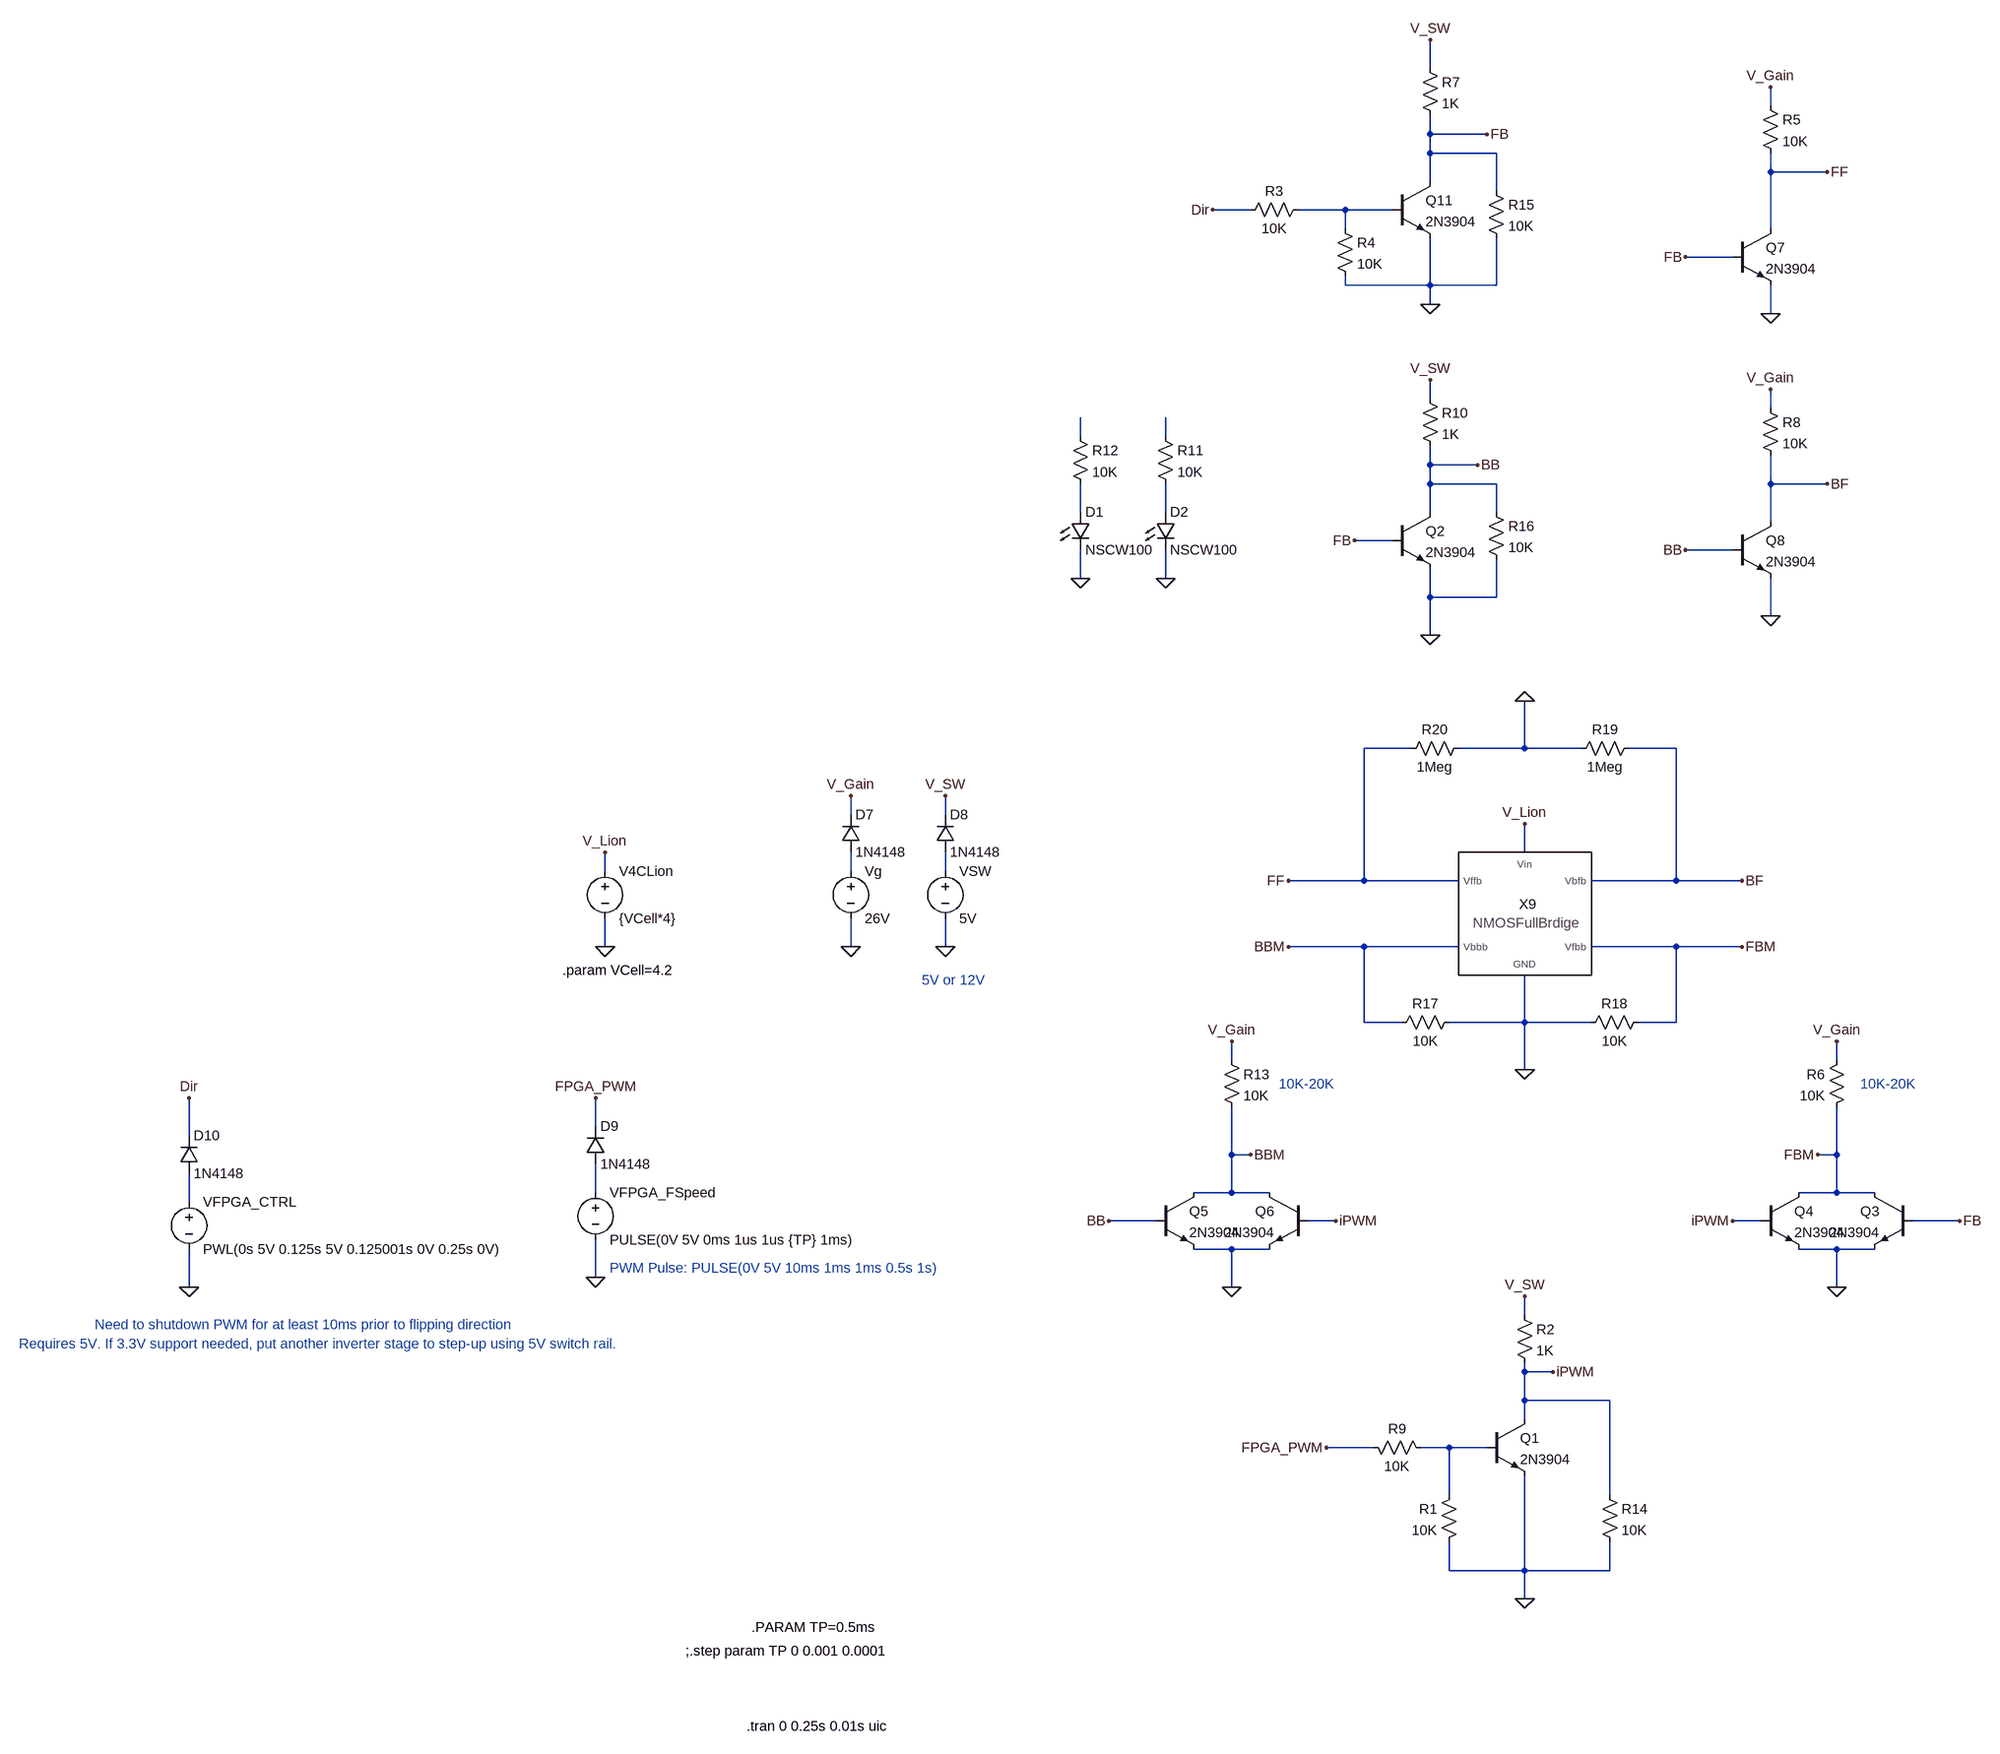
[diagram p0: schematic MotorControllerV2.asc]
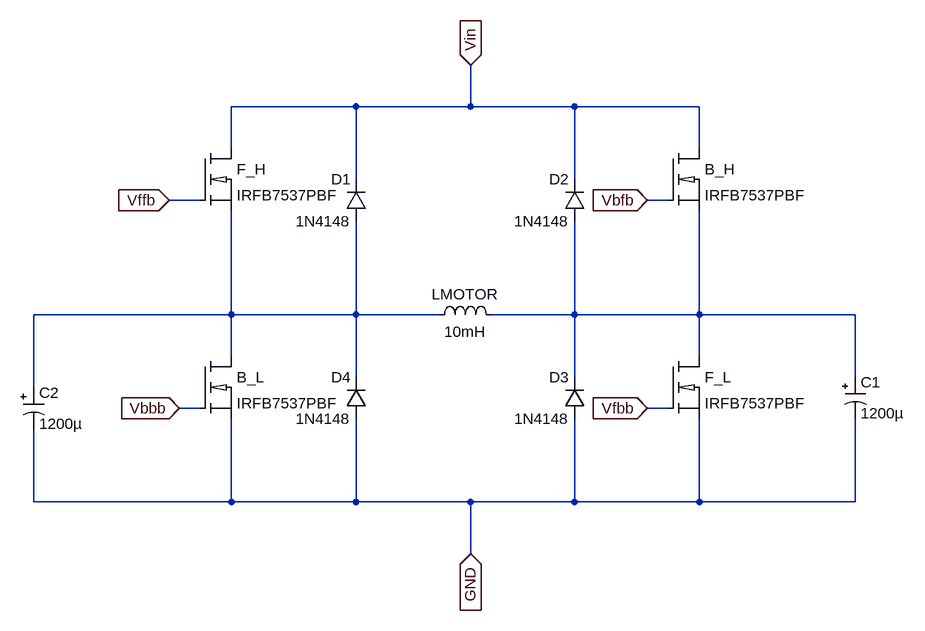
[diagram p1: sub-circuit nmosfullbridge.asc]
MotorControllerV2.asc, the LTspice schematic file:
Version 4
SHEET 1 2712 2204
WIRE 272 -1712 272 -1760
WIRE 848 -1648 848 -1680
WIRE 272 -1600 272 -1632
WIRE 368 -1600 272 -1600
WIRE 272 -1568 272 -1600
WIRE 384 -1568 272 -1568
WIRE 848 -1536 848 -1568
WIRE 944 -1536 848 -1536
WIRE 272 -1520 272 -1568
WIRE 384 -1504 384 -1568
WIRE -32 -1472 -96 -1472
WIRE 128 -1472 48 -1472
WIRE 208 -1472 128 -1472
WIRE 128 -1440 128 -1472
WIRE 848 -1440 848 -1536
WIRE 784 -1392 704 -1392
WIRE 128 -1344 128 -1360
WIRE 272 -1344 272 -1424
WIRE 272 -1344 128 -1344
WIRE 384 -1344 384 -1424
WIRE 384 -1344 272 -1344
WIRE 272 -1312 272 -1344
WIRE 848 -1296 848 -1344
WIRE 272 -1152 272 -1184
WIRE 848 -1136 848 -1168
WIRE -320 -1088 -320 -1120
WIRE -176 -1088 -176 -1120
WIRE 272 -1040 272 -1072
WIRE 352 -1040 272 -1040
WIRE 272 -1008 272 -1040
WIRE 384 -1008 272 -1008
WIRE 848 -1008 848 -1056
WIRE 944 -1008 848 -1008
WIRE -320 -960 -320 -1008
WIRE -176 -960 -176 -1008
WIRE 272 -960 272 -1008
WIRE 384 -960 384 -1008
WIRE 848 -944 848 -1008
WIRE 208 -912 144 -912
WIRE 784 -896 704 -896
WIRE -320 -848 -320 -896
WIRE -176 -848 -176 -896
WIRE 272 -816 272 -864
WIRE 384 -816 384 -880
WIRE 384 -816 272 -816
WIRE 848 -784 848 -848
WIRE 272 -752 272 -816
WIRE 240 -560 160 -560
WIRE 432 -560 432 -640
WIRE 432 -560 320 -560
WIRE 528 -560 432 -560
WIRE 688 -560 608 -560
WIRE -1152 -448 -1152 -480
WIRE -992 -448 -992 -480
WIRE 432 -384 432 -432
WIRE -1568 -352 -1568 -384
WIRE -1152 -352 -1152 -384
WIRE -992 -352 -992 -384
WIRE 160 -336 160 -560
WIRE 160 -336 32 -336
WIRE 320 -336 160 -336
WIRE 688 -336 688 -560
WIRE 688 -336 544 -336
WIRE 800 -336 688 -336
WIRE -1568 -224 -1568 -272
WIRE -1152 -224 -1152 -272
WIRE -992 -224 -992 -272
WIRE 160 -224 32 -224
WIRE 320 -224 160 -224
WIRE 688 -224 544 -224
WIRE 800 -224 688 -224
WIRE 160 -96 160 -224
WIRE 224 -96 160 -96
WIRE 432 -96 432 -176
WIRE 432 -96 304 -96
WIRE 544 -96 432 -96
WIRE 688 -96 688 -224
WIRE 688 -96 624 -96
WIRE -64 -32 -64 -64
WIRE 960 -32 960 -64
WIRE 432 -16 432 -96
WIRE -1584 80 -1584 32
WIRE -2272 96 -2272 32
WIRE -64 128 -64 48
WIRE -32 128 -64 128
WIRE 960 128 960 48
WIRE 960 128 928 128
WIRE -1584 192 -1584 144
WIRE -64 192 -64 128
WIRE -64 192 -128 192
WIRE 0 192 -64 192
WIRE 960 192 960 128
WIRE 960 192 896 192
WIRE 1024 192 960 192
WIRE -2272 208 -2272 160
WIRE -192 240 -272 240
WIRE 112 240 64 240
WIRE 832 240 784 240
WIRE 1168 240 1088 240
WIRE -64 288 -128 288
WIRE 0 288 -64 288
WIRE 960 288 896 288
WIRE 1024 288 960 288
WIRE -1584 336 -1584 272
WIRE -2272 352 -2272 288
WIRE -64 352 -64 288
WIRE 960 352 960 288
WIRE 432 400 432 368
WIRE 432 496 432 480
WIRE 480 496 432 496
WIRE 432 544 432 496
WIRE 576 544 432 544
WIRE 432 576 432 544
WIRE 176 624 96 624
WIRE 304 624 256 624
WIRE 368 624 304 624
WIRE 304 704 304 624
WIRE 576 704 576 544
WIRE 304 832 304 784
WIRE 432 832 432 672
WIRE 432 832 304 832
WIRE 576 832 576 784
WIRE 576 832 432 832
WIRE 432 880 432 832
FLAG -1584 336 0
FLAG -1568 -224 0
FLAG -1568 -384 V_Lion
FLAG -1584 32 FPGA_PWM
FLAG 432 880 0
FLAG 96 624 FPGA_PWM
FLAG 960 352 0
FLAG -64 352 0
FLAG -2272 352 0
FLAG 432 -432 V_Lion
FLAG 432 -16 0
FLAG -1152 -224 0
FLAG -1152 -480 V_Gain
FLAG -992 -224 0
FLAG -992 -480 V_SW
FLAG -64 -64 V_Gain
FLAG 960 -64 V_Gain
FLAG 432 -640 0
FLAG -2272 32 Dir
FLAG 272 -1312 0
FLAG 272 -1760 V_SW
FLAG 432 368 V_SW
FLAG -96 -1472 Dir
FLAG 144 -912 FB
FLAG 32 -336 FF
FLAG 1168 240 FB
FLAG -272 240 BB
FLAG 800 -336 BF
FLAG 848 -1680 V_Gain
FLAG 848 -1296 0
FLAG 944 -1536 FF
FLAG 848 -1168 V_Gain
FLAG 848 -784 0
FLAG 944 -1008 BF
FLAG 704 -896 BB
FLAG 704 -1392 FB
FLAG 32 -224 BBM
FLAG -32 128 BBM
FLAG 800 -224 FBM
FLAG 928 128 FBM
FLAG 480 496 iPWM
FLAG 784 240 iPWM
FLAG 112 240 iPWM
FLAG 272 -752 0
FLAG 272 -1184 V_SW
FLAG 368 -1600 FB
FLAG 352 -1040 BB
FLAG -320 -848 0
FLAG -176 -848 0
SYMBOL voltage -1584 176 R0
WINDOW 123 0 0 Left 2
WINDOW 39 0 0 Left 2
SYMATTR InstName VFPGA_FSpeed
SYMATTR Value PULSE(0V 5V 0ms 1us 1us {TP} 1ms)
SYMBOL voltage -1568 -368 R0
WINDOW 123 0 0 Left 2
WINDOW 39 0 0 Left 2
SYMATTR InstName V4CLion
SYMATTR Value {VCell*4}
SYMBOL npn 368 576 R0
SYMATTR InstName Q1
SYMATTR Value 2N3904
SYMBOL res 320 688 M0
SYMATTR InstName R1
SYMATTR Value 10K
SYMBOL res 416 384 R0
SYMATTR InstName R2
SYMATTR Value 1K
SYMBOL npn 1088 192 M0
SYMATTR InstName Q3
SYMATTR Value 2N3904
SYMBOL res 976 -48 M0
SYMATTR InstName R6
SYMATTR Value 10K
SYMBOL npn 832 192 R0
SYMATTR InstName Q4
SYMATTR Value 2N3904
SYMBOL npn -192 192 R0
SYMATTR InstName Q5
SYMATTR Value 2N3904
SYMBOL res -80 -48 R0
SYMATTR InstName R13
SYMATTR Value 10K
SYMBOL npn 64 192 M0
SYMATTR InstName Q6
SYMATTR Value 2N3904
SYMBOL voltage -2272 192 R0
WINDOW 123 0 0 Left 2
WINDOW 39 0 0 Left 2
SYMATTR InstName VFPGA_CTRL
SYMATTR Value PWL(0s 5V 0.125s 5V 0.125001s 0V 0.25s 0V)
SYMBOL NMOSFullBridge 432 -272 R0
SYMATTR InstName X9
SYMBOL voltage -1152 -368 R0
WINDOW 123 0 0 Left 2
WINDOW 39 0 0 Left 2
SYMATTR InstName Vg
SYMATTR Value 26V
SYMBOL voltage -992 -368 R0
WINDOW 123 0 0 Left 2
WINDOW 39 0 0 Left 2
SYMATTR InstName VSW
SYMATTR Value 5V
SYMBOL res 208 -80 R270
WINDOW 0 32 56 VTop 2
WINDOW 3 0 56 VBottom 2
SYMATTR InstName R17
SYMATTR Value 10K
SYMBOL res 640 -112 R90
WINDOW 0 0 56 VBottom 2
WINDOW 3 32 56 VTop 2
SYMATTR InstName R18
SYMATTR Value 10K
SYMBOL res 624 -576 R90
WINDOW 0 0 56 VBottom 2
WINDOW 3 32 56 VTop 2
SYMATTR InstName R19
SYMATTR Value 1Meg
SYMBOL res 224 -544 R270
WINDOW 0 32 56 VTop 2
WINDOW 3 0 56 VBottom 2
SYMATTR InstName R20
SYMATTR Value 1Meg
SYMBOL npn 208 -1520 R0
SYMATTR InstName Q11
SYMATTR Value 2N3904
SYMBOL npn 784 -1440 R0
SYMATTR InstName Q7
SYMATTR Value 2N3904
SYMBOL res 832 -1664 R0
SYMATTR InstName R5
SYMATTR Value 10K
SYMBOL npn 784 -944 R0
SYMATTR InstName Q8
SYMATTR Value 2N3904
SYMBOL res 832 -1152 R0
SYMATTR InstName R8
SYMATTR Value 10K
SYMBOL res 256 -1728 R0
SYMATTR InstName R7
SYMATTR Value 1K
SYMBOL res 112 -1456 R0
SYMATTR InstName R4
SYMATTR Value 10K
SYMBOL res -48 -1456 R270
WINDOW 0 32 56 VTop 2
WINDOW 3 0 56 VBottom 2
SYMATTR InstName R3
SYMATTR Value 10K
SYMBOL res 160 608 M90
WINDOW 0 0 56 VBottom 2
WINDOW 3 32 56 VTop 2
SYMATTR InstName R9
SYMATTR Value 10K
SYMBOL diode -1168 -384 M180
WINDOW 0 24 64 Left 2
WINDOW 3 24 0 Left 2
SYMATTR InstName D7
SYMATTR Value 1N4148
SYMBOL diode -1008 -384 M180
WINDOW 0 24 64 Left 2
WINDOW 3 24 0 Left 2
SYMATTR InstName D8
SYMATTR Value 1N4148
SYMBOL diode -1600 144 M180
WINDOW 0 24 64 Left 2
WINDOW 3 24 0 Left 2
SYMATTR InstName D9
SYMATTR Value 1N4148
SYMBOL diode -2288 160 M180
WINDOW 0 24 64 Left 2
WINDOW 3 24 0 Left 2
SYMATTR InstName D10
SYMATTR Value 1N4148
SYMBOL npn 208 -960 R0
SYMATTR InstName Q2
SYMATTR Value 2N3904
SYMBOL res 256 -1168 R0
SYMATTR InstName R10
SYMATTR Value 1K
SYMBOL LED -336 -960 R0
SYMATTR InstName D1
SYMATTR Value NSCW100
SYMBOL LED -192 -960 R0
SYMATTR InstName D2
SYMATTR Value NSCW100
SYMBOL res -192 -1104 R0
SYMATTR InstName R11
SYMATTR Value 10K
SYMBOL res -336 -1104 R0
SYMATTR InstName R12
SYMATTR Value 10K
SYMBOL res 560 688 R0
SYMATTR InstName R14
SYMATTR Value 10K
SYMBOL res 368 -1520 R0
SYMATTR InstName R15
SYMATTR Value 10K
SYMBOL res 368 -976 R0
SYMATTR InstName R16
SYMATTR Value 10K
TEXT -1328 1096 Left 2 !.tran 0 0.25s 0.01s uic
TEXT -1560 320 Left 2 ;PWM Pulse: PULSE(0V 5V 10ms 1ms 1ms 0.5s 1s)
TEXT -1640 -184 Left 2 !.param VCell=4.2
TEXT -1432 968 Left 2 !;.step param TP 0 0.001 0.0001
TEXT -1320 928 Left 2 !.PARAM TP=0.5ms
TEXT -2560 448 Left 2 ;Requires 5V. If 3.3V support needed, put another inverter stage to step-up using 5V switch rail.
TEXT -2432 416 Left 2 ;Need to shutdown PWM for at least 10ms prior to flipping direction
TEXT 1000 8 Left 2 ;10K-20K
TEXT 16 8 Left 2 ;10K-20K
TEXT -1032 -168 Left 2 ;5V or 12V

nmosfullbridge.asc, the sub-circuit schematic file:
Version 4
SHEET 1 2712 2204
WIRE 1664 -576 1472 -576
WIRE 1840 -576 1840 -640
WIRE 1840 -576 1664 -576
WIRE 2000 -576 1840 -576
WIRE 2192 -576 2000 -576
WIRE 1472 -512 1472 -576
WIRE 2192 -512 2192 -576
WIRE 1664 -464 1664 -576
WIRE 2000 -464 2000 -576
WIRE 1424 -432 1376 -432
WIRE 2144 -432 2112 -432
WIRE 1472 -256 1472 -416
WIRE 1472 -256 1168 -256
WIRE 1664 -256 1664 -400
WIRE 1664 -256 1472 -256
WIRE 1792 -256 1664 -256
WIRE 2000 -256 2000 -400
WIRE 2000 -256 1872 -256
WIRE 2192 -256 2192 -416
WIRE 2192 -256 2000 -256
WIRE 2432 -256 2192 -256
WIRE 1472 -192 1472 -256
WIRE 2192 -192 2192 -256
WIRE 1664 -160 1664 -256
WIRE 2000 -160 2000 -256
WIRE 2432 -160 2432 -256
WIRE 1168 -144 1168 -256
WIRE 1424 -112 1392 -112
WIRE 2144 -112 2112 -112
WIRE 1168 32 1168 -80
WIRE 1472 32 1472 -96
WIRE 1472 32 1168 32
WIRE 1664 32 1664 -96
WIRE 1664 32 1472 32
WIRE 1840 32 1664 32
WIRE 2000 32 2000 -96
WIRE 2000 32 1840 32
WIRE 2192 32 2192 -96
WIRE 2192 32 2000 32
WIRE 2432 32 2432 -96
WIRE 2432 32 2192 32
WIRE 1840 112 1840 32
FLAG 1840 -640 Vin
IOPIN 1840 -640 In
FLAG 1376 -432 Vffb
IOPIN 1376 -432 In
FLAG 2112 -432 Vbfb
IOPIN 2112 -432 In
FLAG 2112 -112 Vfbb
IOPIN 2112 -112 In
FLAG 1392 -112 Vbbb
IOPIN 1392 -112 In
FLAG 1840 112 GND
IOPIN 1840 112 In
SYMBOL ind 1776 -240 R270
WINDOW 0 32 56 VTop 2
WINDOW 3 5 56 VBottom 2
SYMATTR InstName LMOTOR
SYMATTR Value 10mH
SYMATTR SpiceLine Ipk=173 Rser=2.5 Rpar=2.5 Cpar=0
SYMBOL IRFB7537PBF 1424 -512 R0
SYMATTR InstName F_H
SYMBOL IRFB7537PBF 1424 -192 R0
SYMATTR InstName B_L
SYMBOL IRFB7537PBF 2144 -512 R0
SYMATTR InstName B_H
SYMBOL IRFB7537PBF 2144 -192 R0
SYMATTR InstName F_L
SYMBOL diode 1680 -400 R180
WINDOW 0 24 64 Left 2
WINDOW 3 24 0 Left 2
SYMATTR InstName D1
SYMATTR Value 1N4148
SYMBOL diode 2016 -400 R180
WINDOW 0 24 64 Left 2
WINDOW 3 24 0 Left 2
SYMATTR InstName D2
SYMATTR Value 1N4148
SYMBOL diode 2016 -96 R180
WINDOW 0 24 64 Left 2
WINDOW 3 24 0 Left 2
SYMATTR InstName D3
SYMATTR Value 1N4148
SYMBOL diode 1680 -96 R180
WINDOW 0 24 64 Left 2
WINDOW 3 24 0 Left 2
SYMATTR InstName D4
SYMATTR Value 1N4148
SYMBOL polcap 2416 -160 R0
WINDOW 3 24 56 Left 2
SYMATTR Value 1200µ
SYMATTR InstName C1
SYMATTR Description Capacitor
SYMATTR Type cap
SYMATTR SpiceLine V=35 Irms=2.22 Rser=0.024 Lser=0 mfg="United Chemi-Con" pn="LXF35VB122M12X35LL" type="Al electrolytic"
SYMBOL polcap 1152 -144 R0
WINDOW 3 24 56 Left 2
SYMATTR Value 1200µ
SYMATTR InstName C2
SYMATTR Description Capacitor
SYMATTR Type cap
SYMATTR SpiceLine V=35 Irms=2.22 Rser=0.024 Lser=0 mfg="United Chemi-Con" pn="LXF35VB122M12X35LL" type="Al electrolytic"

The netlist it stands for:
* MotorControllerV2.asc
VFPGA_FSpeed N008 0 PULSE(0V 5V 0ms 1us 1us {TP} 1ms)
V4CLion V_Lion 0 {VCell*4}
Q1 iPWM N010 0 0 2N3904
R1 N010 0 10K
R2 V_SW iPWM 1K
Q3 FBM FB 0 0 2N3904
R6 V_Gain FBM 10K
Q4 FBM iPWM 0 0 2N3904
Q5 BBM BB 0 0 2N3904
R13 V_Gain BBM 10K
Q6 BBM iPWM 0 0 2N3904
VFPGA_CTRL N009 0 PWL(0s 5V 0.125s 5V 0.125001s 0V 0.25s 0V)
XX9 BBM BF FBM FF V_Lion 0 nmosfullbridge
Vg N006 0 26V
VSW N007 0 5V
R17 BBM 0 10K
R18 FBM 0 10K
R19 BF 0 1Meg
R20 FF 0 1Meg
Q11 FB N001 0 0 2N3904
Q7 FF FB 0 0 2N3904
R5 V_Gain FF 10K
Q8 BF BB 0 0 2N3904
R8 V_Gain BF 10K
R7 V_SW FB 1K
R4 N001 0 10K
R3 Dir N001 10K
R9 FPGA_PWM N010 10K
D7 N006 V_Gain 1N4148
D8 N007 V_SW 1N4148
D9 N008 FPGA_PWM 1N4148
D10 N009 Dir 1N4148
Q2 BB FB 0 0 2N3904
R10 V_SW BB 1K
D1 N004 0 NSCW100
D2 N005 0 NSCW100
R11 N003 N005 10K
R12 N002 N004 10K
R14 iPWM 0 10K
R15 FB 0 10K
R16 BB 0 10K

* block symbol definitions
.subckt nmosfullbridge Vbbb Vbfb Vfbb Vffb Vin GND
LMOTOR N001 N002 10mH Ipk=173 Rser=2.5 Rpar=2.5 Cpar=0
XF_H Vin Vffb N001 IRFB7537PBF  ; pins D G S
XB_L N001 Vbbb GND IRFB7537PBF  ; pins D G S
XB_H Vin Vbfb N002 IRFB7537PBF  ; pins D G S
XF_L N002 Vfbb GND IRFB7537PBF  ; pins D G S
D1 N001 Vin 1N4148
D2 N002 Vin 1N4148
D3 GND N002 1N4148
D4 GND N001 1N4148
C1 N002 GND 1200µ V=35 Irms=2.22 Rser=0.024 Lser=0 mfg="United Chemi-Con" pn="LXF35VB122M12X35LL" type="Al electrolytic"
C2 N001 GND 1200µ V=35 Irms=2.22 Rser=0.024 Lser=0 mfg="United Chemi-Con" pn="LXF35VB122M12X35LL" type="Al electrolytic"
.ends nmosfullbridge

.model D D
.lib standard.dio
.model NPN NPN
.model PNP PNP
.lib standard.bjt
.tran 0 0.25s 0.01s uic
* PWM Pulse: PULSE(0V 5V 10ms 1ms 1ms 0.5s 1s)
.param VCell=4.2
;.step param TP 0 0.001 0.0001
.PARAM TP=0.5ms
* Requires 5V. If 3.3V support needed, put another inverter stage to step-up using 5V switch rail.
* Need to shutdown PWM for at least 10ms prior to flipping direction
* 10K-20K
* 10K-20K
* 5V or 12V
.lib .\IRFB7537PBF.cir
.backanno
.end